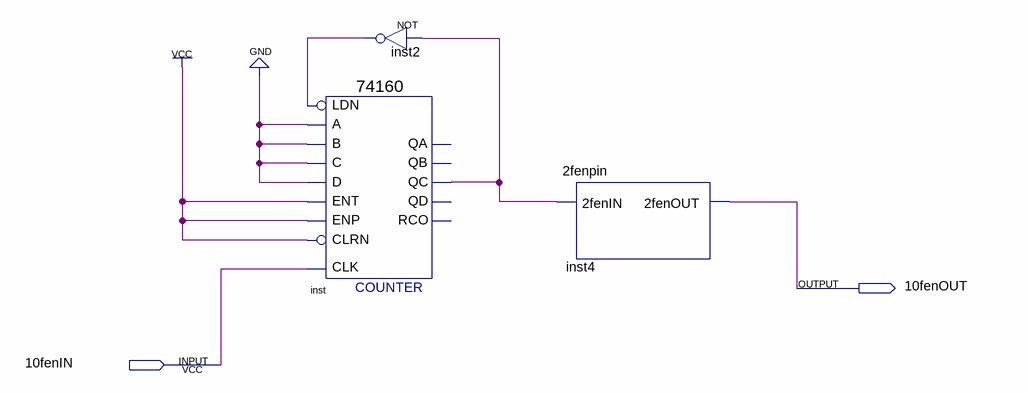
[diagram p0: schematic sheet]
// Quartus schematic 10fenpin.bdf as structural Verilog: 3 symbols, 2 pins
module \10fenpin  (
  input  \10fenIN ,
  output \10fenOUT 
);

  wire inst2_out, inst_qc;

  \74160  inst (
    .CLK(\10fenIN ), .ENT(1'b1), .A(1'b0), .B(1'b0), .C(1'b0), .D(1'b0), .LDN(inst2_out), .ENP(1'b1),
    .CLRN(1'b1), .QC(inst_qc));  // open: QD, QA, QB, RCO
  not inst2 (inst2_out, inst_qc);
  \2fenpin  inst4 (.\2fenIN (inst_qc), .\2fenOUT (\10fenOUT ));
endmodule
